# Altium schematic sheet SMU_STPM_Board.SchDoc
size A; SheetNumber: 1; SheetTotal: 3
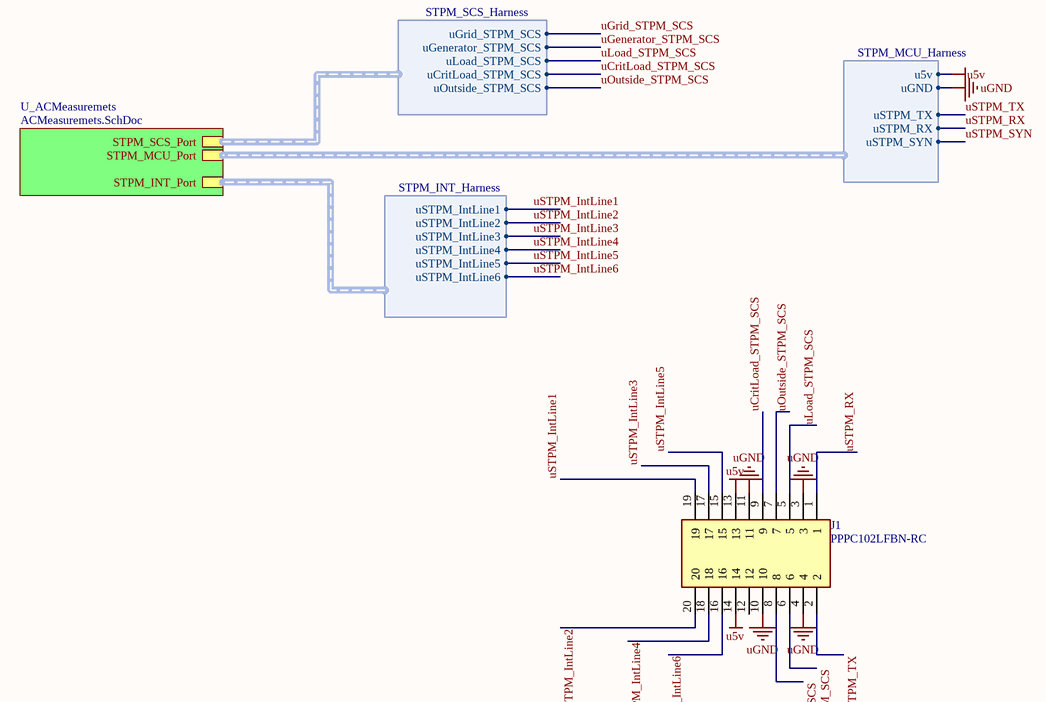
[diagram p0: SMU_STPM_Board.SchDoc]

## Parts
J1  PPPC102LFBN-RC  [RHDR20W85P254_2X10_2590X508X880P]

## Sub-sheets
U_ACMeasuremets = ACMeasuremets.SchDoc: STPM_SCS_Port (harness STPM_SCS_Harness), STPM_MCU_Port (harness STPM_MCU_Harness), STPM_INT_Port (harness STPM_INT_Harness)

## Harnesses
STPM_MCU_Harness: u5v, uGND, uSTPM_TX, uSTPM_SYN, uSTPM_RX
STPM_SCS_Harness: uGrid_STPM_SCS, uGenerator_STPM_SCS, uLoad_STPM_SCS, uCritLoad_STPM_SCS, uOutside_STPM_SCS
STPM_INT_Harness: uSTPM_IntLine1, uSTPM_IntLine2, uSTPM_IntLine3, uSTPM_IntLine4, uSTPM_IntLine5, uSTPM_IntLine6

## Nets
u5v: J1.13 J1.14 ; sheet U_ACMeasuremets/STPM_MCU_Port.u5v
uGND: J1.3 J1.4 J1.10 J1.11 ; sheet U_ACMeasuremets/STPM_MCU_Port.uGND
uCritLoad_STPM_SCS: J1.9 ; sheet U_ACMeasuremets/STPM_SCS_Port.uCritLoad_STPM_SCS
uGenerator_STPM_SCS: J1.8 ; sheet U_ACMeasuremets/STPM_SCS_Port.uGenerator_STPM_SCS
uGrid_STPM_SCS: J1.6 ; sheet U_ACMeasuremets/STPM_SCS_Port.uGrid_STPM_SCS
uLoad_STPM_SCS: J1.5 ; sheet U_ACMeasuremets/STPM_SCS_Port.uLoad_STPM_SCS
uOutside_STPM_SCS: J1.7 ; sheet U_ACMeasuremets/STPM_SCS_Port.uOutside_STPM_SCS
uSTPM_IntLine1: J1.19 ; sheet U_ACMeasuremets/STPM_INT_Port.uSTPM_IntLine1
uSTPM_IntLine2: J1.20 ; sheet U_ACMeasuremets/STPM_INT_Port.uSTPM_IntLine2
uSTPM_IntLine3: J1.17 ; sheet U_ACMeasuremets/STPM_INT_Port.uSTPM_IntLine3
uSTPM_IntLine4: J1.18 ; sheet U_ACMeasuremets/STPM_INT_Port.uSTPM_IntLine4
uSTPM_IntLine5: J1.15 ; sheet U_ACMeasuremets/STPM_INT_Port.uSTPM_IntLine5
uSTPM_IntLine6: J1.16 ; sheet U_ACMeasuremets/STPM_INT_Port.uSTPM_IntLine6
uSTPM_RX: J1.1 ; sheet U_ACMeasuremets/STPM_MCU_Port.uSTPM_RX
uSTPM_SYN: sheet U_ACMeasuremets/STPM_MCU_Port.uSTPM_SYN
uSTPM_TX: J1.2 ; sheet U_ACMeasuremets/STPM_MCU_Port.uSTPM_TX

Not connected (* = marked no-connect by the designer): J1 12

## Library data of the parts
J1 = PPPC102LFBN-RC: Connector; Manufacturer_Name: Sullins; Datasheet Link: https://www.digikey.in/en/datasheets/sullins-connector-solutions/sullins-connector-solutions78pnpxcxxxlfbnrc10492h; Height: 8.8mm; Manufacturer_Part_Number: PPPC102LFBN-RC; Digi-Key_Part_Number: S6106-ND